# EAGLE design C5 Ambilight (EAGLE 9.2.2)
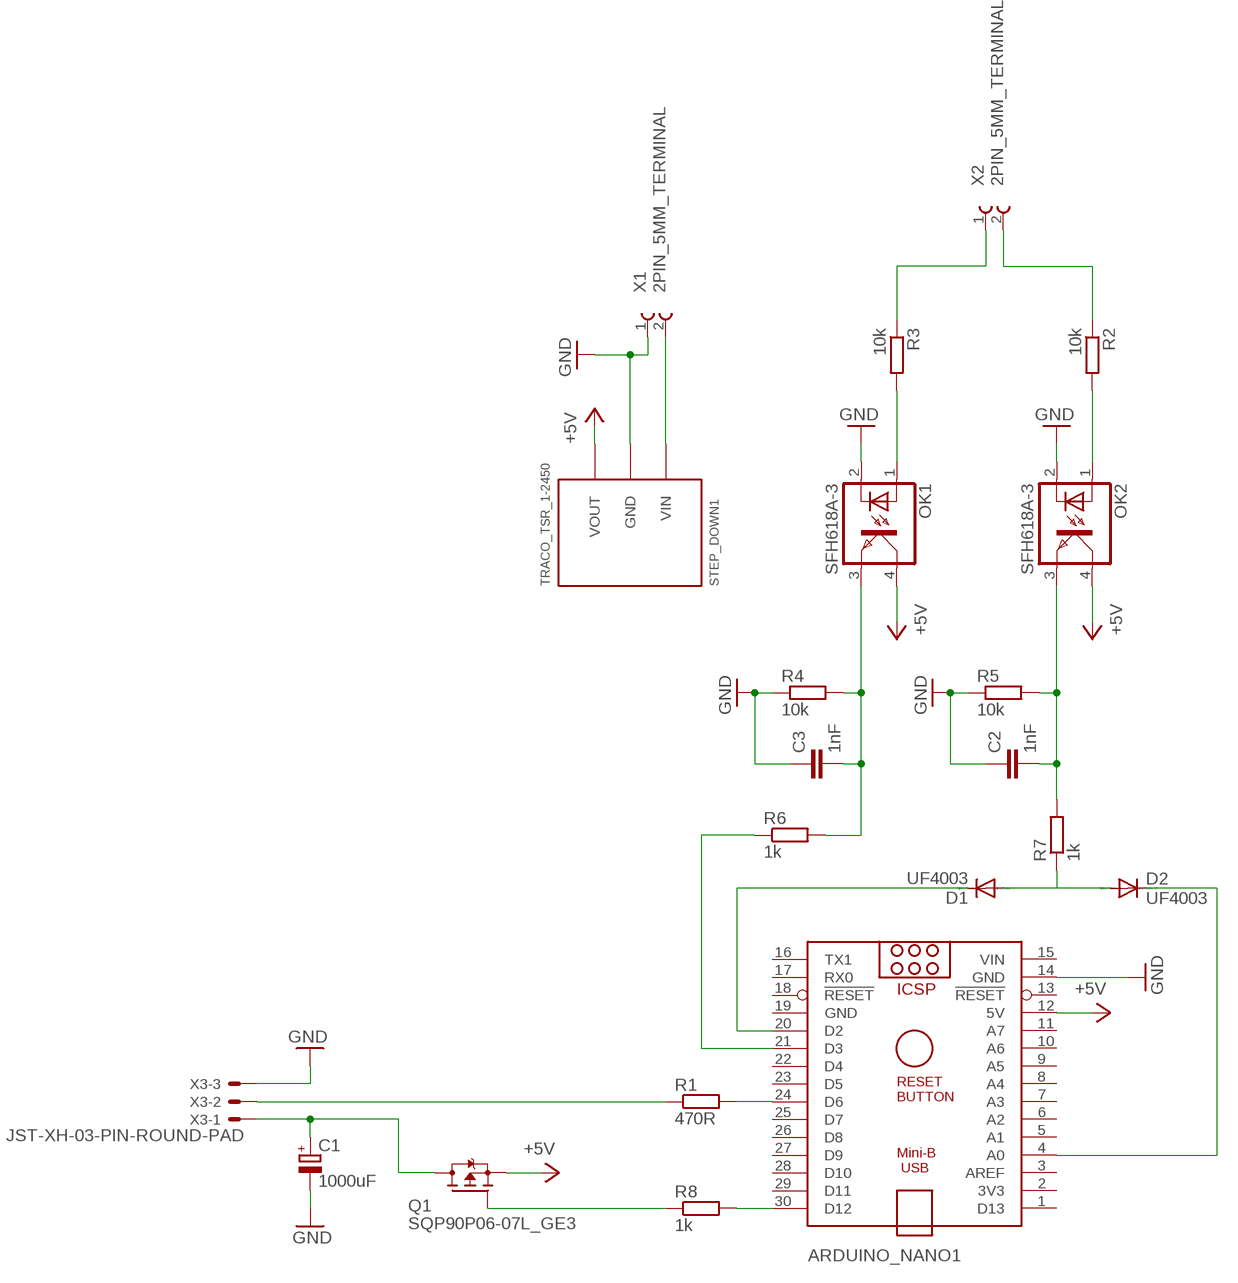
[diagram p0: schematic, sheet 1]

## Parts
ARDUINO_NANO1  ARDUINO_NANO  [ARDUINO_NANO]
C1  1000uF  CPOL-EUTT5D10  [TT5D10]
C2  1nF  C-EU050-025X075  [C050-025X075]
C3  1nF  C-EU050-025X075  [C050-025X075]
D1  UF4003  [DO41-10]
D2  UF4003  [DO41-10]
OK1  SFH618A-3  [DIP4]
OK2  SFH618A-3  [DIP4]
Q1  SQP90P06-07L_GE3  VISHAY_SQP90P06-07LTO220V  [TO220V]
R1  470R  R-EU_0207/10  [0207/10]
R2  10k  R-EU_0207/7  [0207/7]
R3  10k  R-EU_0207/7  [0207/7]
R4  10k  R-EU_0207/10  [0207/10]
R5  10k  R-EU_0207/10  [0207/10]
R6  1k  R-EU_0207/10  [0207/10]
R7  1k  R-EU_0207/10  [0207/10]
R8  1k  R-EU_0207/10  [0207/10]
STEP_DOWN1  TRACO_TSR_1-2450  [TRACO_TSR_1-2450]
X1  2PIN_5MM_TERMINAL  [2PIN_5MM_TERMMINAL]
X2  2PIN_5MM_TERMINAL  [2PIN_5MM_TERMMINAL]
X3  JST-XH-03-PIN-ROUND-PAD  [JST-XH-03-PACKAGE-ROUND-PAD]

## Nets
5V_LED: C1.+ Q1.2(D) X3.1
12V: STEP_DOWN1.VIN X1.2
+5V: ARDUINO_NANO1.12(5V) OK1.4(COL) OK2.4(COL) Q1.3(S) STEP_DOWN1.VOUT
GND: ARDUINO_NANO1.14(GND) C1.- C2.1 C3.1 OK1.2(C) OK2.2(C) R4.1 R5.1 STEP_DOWN1.GND X1.1 X3.3
N$1: ARDUINO_NANO1.30(D12) R8.2
N$2: ARDUINO_NANO1.24(D6) R1.2
N$3: R2.1 X2.2
N$4: R1.1 X3.2
N$5: R3.1 X2.1
N$6: OK1.1(A) R3.2
N$7: OK2.1(A) R2.2
N$8: C3.2 OK1.3(EMIT) R4.2 R6.2
N$9: C2.2 OK2.3(EMIT) R5.2 R7.2
N$10: Q1.1(G) R8.1
N$11: ARDUINO_NANO1.21(D3) R6.1
N$12: ARDUINO_NANO1.20(D2) D1.C
N$13: ARDUINO_NANO1.4(A0) D2.C
N$14: D1.A D2.A R7.1
Unconnected: ARDUINO_NANO1.1(D13) ARDUINO_NANO1.2(3V3) ARDUINO_NANO1.3(AREF) ARDUINO_NANO1.5(A1) ARDUINO_NANO1.6(A2) ARDUINO_NANO1.7(A3) ARDUINO_NANO1.8(A4) ARDUINO_NANO1.9(A5) ARDUINO_NANO1.10(A6) ARDUINO_NANO1.11(A7) ARDUINO_NANO1.13(!RESET) ARDUINO_NANO1.16(TX1) ARDUINO_NANO1.17(RX0) ARDUINO_NANO1.18(!RESET) ARDUINO_NANO1.22(D4) ARDUINO_NANO1.23(D5) ARDUINO_NANO1.25(D7) ARDUINO_NANO1.26(D8) ARDUINO_NANO1.27(D9) ARDUINO_NANO1.28(D10) ARDUINO_NANO1.29(D11)

## Power pins joined to a net without a drawn wire
GND: ARDUINO_NANO1.19(GND)
VIN: ARDUINO_NANO1.15(VIN)

## Library data of the parts
ARDUINO_NANO1 = Nano:ARDUINO_NANO: Arduino Nano V3.0 Overview: The Arduino Nano is a small, complete, and breadboard-friendly board based on the ATmega328 (Arduino Nano 3.x) or ATmega168 (Arduino Nano 2.x). It has more or less the same functionality of the Arduino Duemilanove, but in a different package. It lacks only a DC power jack, and works with a Mini-B USB cable instead of a standard one. The Nano was designed and is being produced by Gravitech. Specifications: Microcontroller Atmel ATmega168 or ATmega328 Operating Voltage (logic level) 5 V Input Voltage (recommended) 7-12 V Input Voltage (limits) 6-20 V Digital I/O Pins 14 (of which 6 provide PWM output) Analog Input Pins 8 DC Current per I/O Pin 40 mA Flash Memory 16 KB (ATmega168) or 32 KB (ATmega328) of which 2 KB used by bootloader SRAM 1 KB (ATmega168) or 2 KB (ATmega328) EEPROM 512 bytes (ATmega168) or 1 KB (ATmega328) Clock Speed 16 MHz Dimensions 0.73" x 1.70" Length 45 mm Width 18 mm Weigth 5 g Power: The Arduino Nano can be powered via the Mini-B USB connection, 6-20V unregulated external power supply (pin 30), or 5V regulated external power supply (pin 27). The power source is automatically selected to the highest voltage source. Memory: The ATmega168 has 16 KB of flash memory for storing code (of which 2 KB is used for the bootloader); the ATmega328 has 32 KB, (also with 2 KB used for the bootloader). The ATmega168 has 1 KB of SRAM and 512 bytes of EEPROM (which can be read and written with the EEPROM library); the ATmega328 has 2 KB of SRAM and 1 KB of EEPROM. Input and Output: Each of the 14 digital pins on the Nano can be used as an input or output, using pinMode(), digitalWrite(), and digitalRead() functions. They operate at 5 volts. Each pin can provide or receive a maximum of 40 mA and has an internal pull-up resistor (disconnected by default) of 20-50 kOhms. In addition, some pins have specialized functions. Visit Arduino - ArduinoBoardNano <https://www.arduino.cc/en/Main/ArduinoBoardNano>
C1 = resistor:CPOL-EU: POLARIZED CAPACITOR, European symbol
C2 C3 = resistor:C-EU: CAPACITOR, European symbol
D1 D2 = diode:UF4003: DIODE ultrafast recovery diode, 200 V rectifier
OK1 OK2 = optocoupler:SFH618?*: Optocoupler, Phototransistor Output, Low Input Current Source: Data sheet <http://www.vishay.com/docs/83673/sfh618.pdf>; MF: VISHAY/TELEFUNKEN; MPN: SFH618A-3; OC_FARNELL: 1020374; OC_NEWARK: 58K2209
Q1 = transistor-fet:VISHAY_SQP90P06-07L
R1-R8 = resistor:R-EU_: RESISTOR, European symbol
STEP_DOWN1 = Voltage:TRACO_TSR_1-2450
X1 X2 = Terminaly:2PIN_5MM_TERMINAL
X3 = JST XH Connectors v1-0:JST-XH-03-PIN: JST XH Connector 2 Pin Wire to board connector. Pitch: 2,54 mm, (0.100") Number of pins: 3 Created by Rembrandt Electronics www.rembrandtelectronics.com

## Board
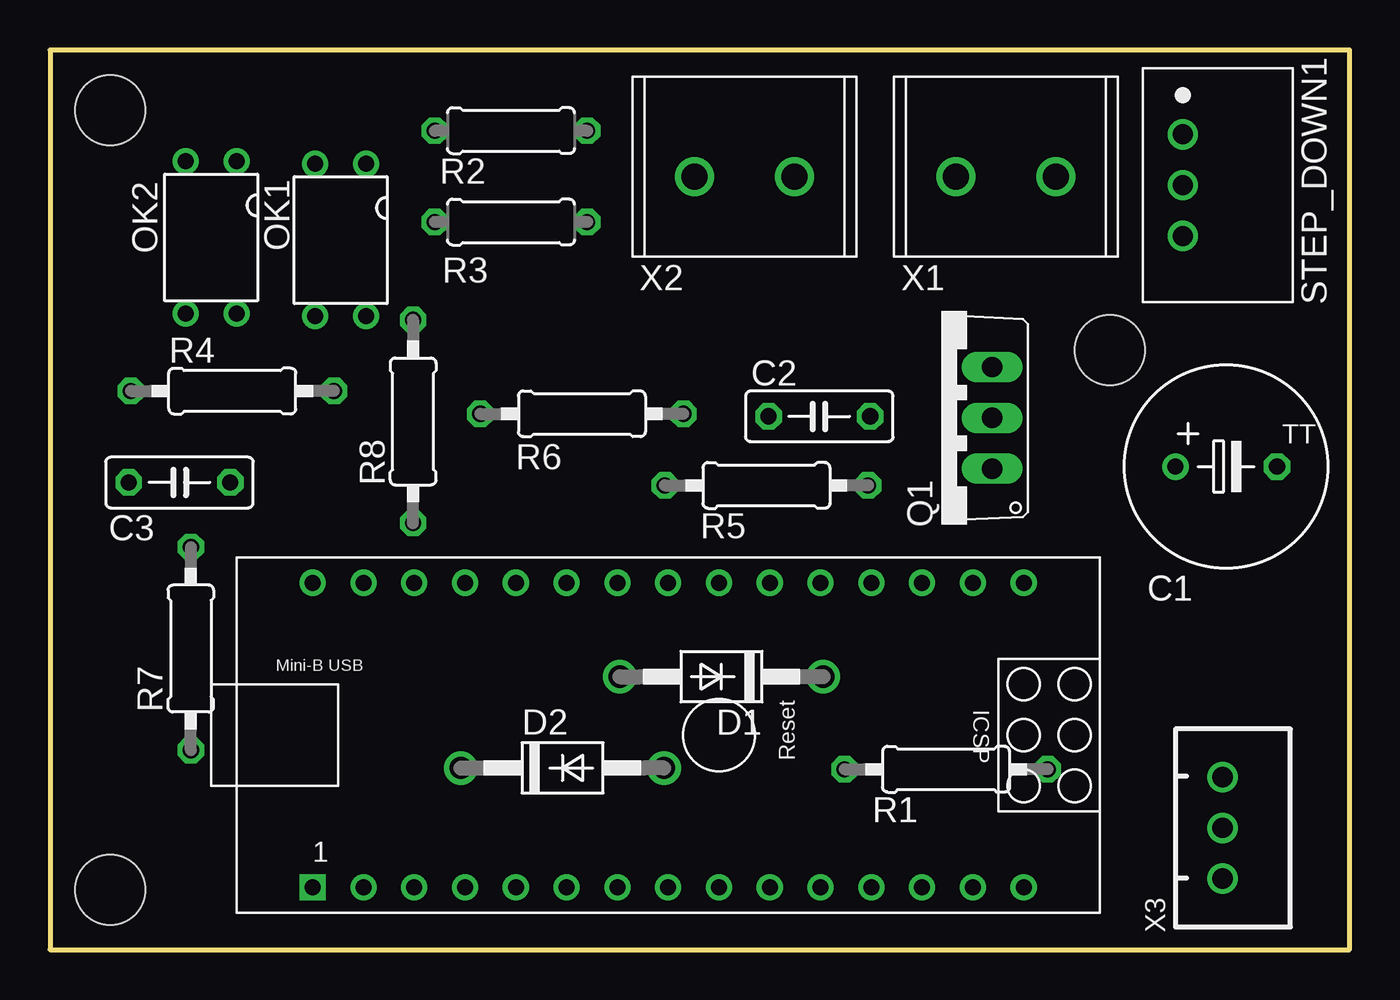
[diagram p1: board, top side]
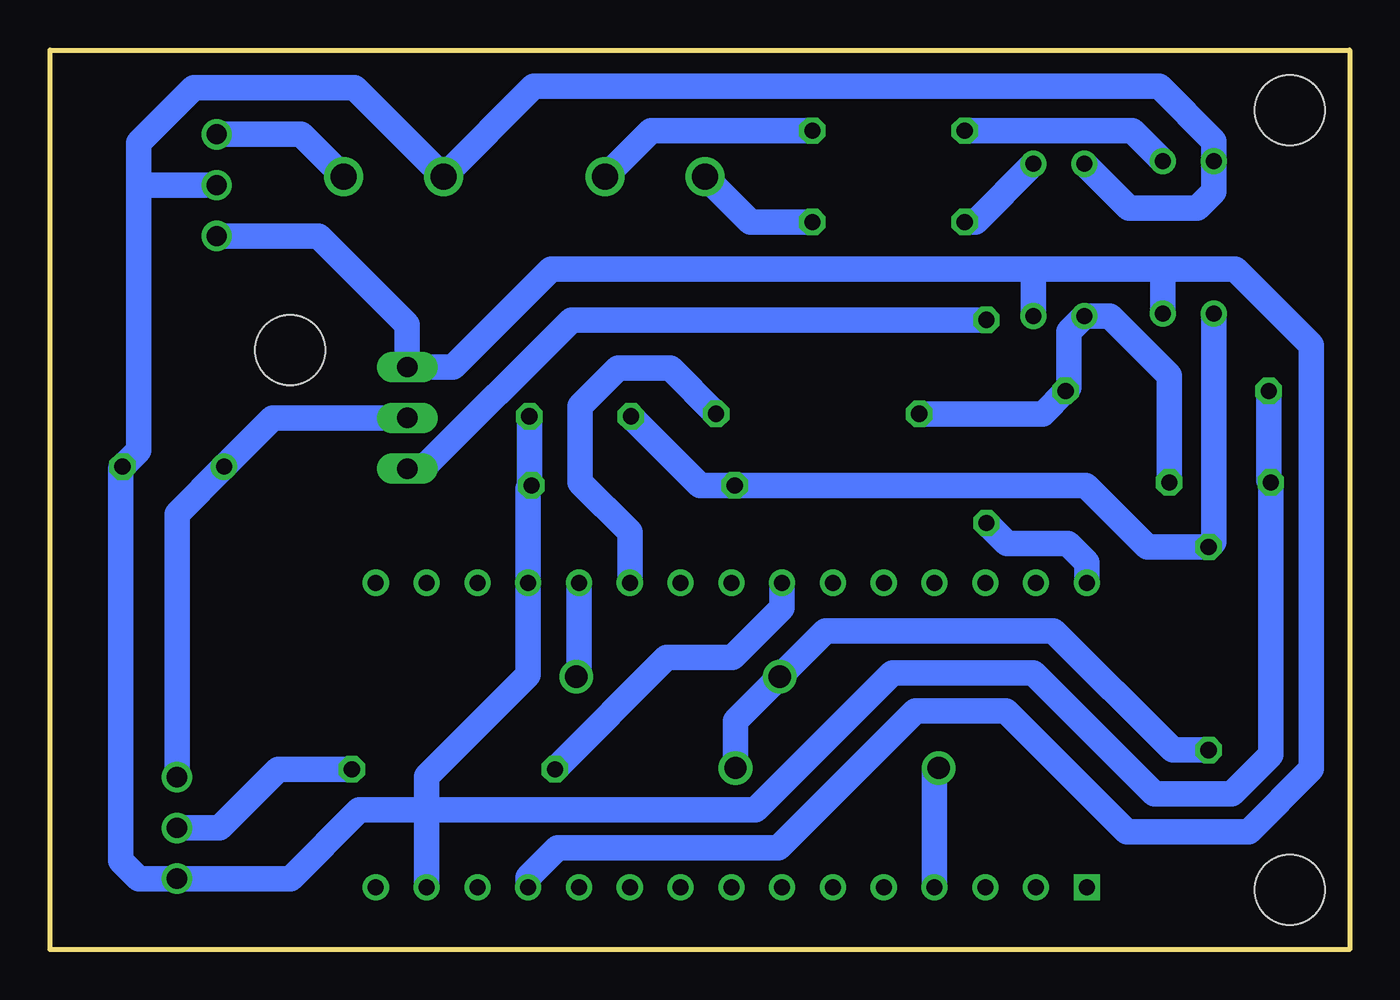
[diagram p2: board, bottom side, seen from below]

Size 65 x 45 mm. Coordinates in mm from the lower left corner, seen from the top.
Outline: 0,0 65,0 65,45 0,45 0,0
Copper layers (1*16): Top 0.035mm / dielectric 1.5mm / Bottom 0.035mm
Design rules "default": minimum track width 6mil, minimum drill 0.35mm, track to track 6mil, track to pad 6mil, pad to pad 6mil, via to via 6mil, smd to smd 6mil, copper to edge 40mil, drill to drill 6mil, minimum pad ring 10mil, minimum via ring 8mil, stop-mask expansion 4mil, vias tented up to drill 0mil, thermal gap 10mil
Holes 3.5 mm at 3,42 3,3 53,30

### Footprints (pad centres in the part's own frame; a part is rotated, then mirrored left to right if it is on the bottom)
ARDUINO_NANO = drill 0.8 square: 1 -20.32,-7.62 | drill 0.8: 2 -17.78,-7.62; 3 -15.24,-7.62; 4 -12.7,-7.62; 5 -10.16,-7.62; 6 -7.62,-7.62; 7 -5.08,-7.62; 8 -2.54,-7.62; 9 0,-7.62; 10 2.54,-7.62; 11 5.08,-7.62; 12 7.62,-7.62; 13 10.16,-7.62; 14 12.7,-7.62; 15 15.24,-7.62; 16 15.24,7.62; 17 12.7,7.62; 18 10.16,7.62; 19 7.62,7.62; 20 5.08,7.62; 21 2.54,7.62; 22 0,7.62; 23 -2.54,7.62; 24 -5.08,7.62; 25 -7.62,7.62; 26 -10.16,7.62; 27 -12.7,7.62; 28 -15.24,7.62; 29 -17.78,7.62; 30 -20.32,7.62
TT5D10 = drill 0.813: + -2.54,0 | drill 0.813 octagon: - 2.54,0
C050-025X075 = drill 0.813 octagon: 1 -2.54,0; 2 2.54,0
DO41-10 = drill 1.118: A 5.08,0; C -5.08,0
DIP4 = drill 0.8: 1 -1.27,-3.81; 2 1.27,-3.81; 3 1.27,3.81; 4 -1.27,3.81
TO220V = drill 1.016 long: 1 -2.54,-2.54; 2 0,-2.54; 3 2.54,-2.54
0207/10 = drill 0.813 octagon: 1 -5.08,0; 2 5.08,0
0207/7 = drill 0.813 octagon: 1 -3.81,0; 2 3.81,0
TRACO_TSR_1-2450 = drill 1: GND -0.01,-1.75; VIN -2.55,-1.75; VOUT 2.53,-1.75
2PIN_5MM_TERMMINAL = drill 1.3: 1 -2.5,0; 2 2.5,0
JST-XH-03-PACKAGE-ROUND-PAD = drill 1.016: 1 -2.54,0; 2 0,0; 3 2.54,0

### Placement (x,y rotation side)
ARDUINO_NANO1  33.46,10.73 0 top
C1  58.83,24.16 0 top
C2  38.48,26.67 180 top
C3  6.48,23.37 0 top
D1  33.59,13.65 180 top
D2  25.63,9.09 0 top
OK1  14.54,35.49 180 top
OK2  8.06,35.62 180 top
Q1  44.59,26.6 90 top
R1  44.82,9.02 180 top
R2  23.05,40.96 180 top
R3  23.05,36.39 180 top
R4  9.12,27.94 0 top
R5  35.84,23.22 180 top
R6  26.6,26.8 180 top
R7  7.04,15.06 90 top
R8  18.16,26.42 270 top
STEP_DOWN1  58.42,38.23 270 top
X1  47.82,38.67 0 top
X2  34.73,38.67 0 top
X3  58.65,6.09 270 top

### Tracks (layer width: path | path; a pad name or v marks a point on that pad's centre or on a via)
5V_LED
  Bottom 1.27: Q1.2 53.85,26.6 C1.+ 58.65,21.8 X3.1
12V
  Bottom 1.27: X1.2 52.43,40.78 STEP_DOWN1.VIN
+5V
  Bottom 1.27: STEP_DOWN1.VOUT 51.57,35.7 47.13,31.26 Q1.3 44.83,29.14 39.93,34.04 15.81,34.04 | 15.81,34.04 OK1.4 | 9.33,34.04 5.71,34.04 1.91,30.23 1.91,9.03 5.03,5.9 11.14,5.9 17.18,11.94 21.72,11.94 28.57,5.08 39.62,5.08 41.08,3.62 ARDUINO_NANO1.12 | OK2.4 9.33,34.04 | 9.33,34.04 15.81,34.04
GND
  Bottom 1.27: STEP_DOWN1.GND 60.57,38.24 | 60.57,38.24 60.57,40.36 57.82,43.11 49.76,43.11 X1.1 40.81,43.18 9.53,43.18 6.79,40.45 OK2.2 6.79,37.91 7.62,37.08 11.05,37.08 OK1.2 | 60.57,38.24 60.57,24.96 C1.- 61.47,24.06 61.47,4.45 60.57,3.55 X3.3 52.97,3.55 49.53,6.99 46.16,6.99 | 46.16,4 ARDUINO_NANO1.14 46.16,6.99 | C2.1 41.02,23.32 R5.1 41.08,23.05 ARDUINO_NANO1.19 41.08,13.75 46.16,8.67 46.16,6.99 | 46.16,6.99 29.72,6.99 22.86,13.84 15.81,13.84 9.76,7.79 5.9,7.79 3.94,9.74 C3.1 4.04,23.47 R4.1
N$1
  Bottom 1.27: ARDUINO_NANO1.30 13.14,19.36 14.1,20.32 17.14,20.32 R8.2
N$2
  Bottom 1.27: ARDUINO_NANO1.24 28.38,17.09 30.86,14.61 34.15,14.61 R1.2
N$3
  Bottom 1.27: R2.1 33.3,40.96 34.94,40.96 X2.2
N$4
  Bottom 1.27: X3.2 56.52,6.09 53.59,9.02 R1.1
N$5
  Bottom 1.27: X2.1 29.95,36.39 R3.1
N$6
  Bottom 1.27: OK1.1 18.72,36.39 R3.2
N$7
  Bottom 1.27: R2.2 10.86,40.96 OK2.1
N$8
  Bottom 1.27: C3.2 9.02,28.7 12,31.68 OK1.3 14.03,30.92 14.03,28.11 R4.2 15.35,26.8 R6.2
N$9
  Bottom 1.27: OK2.3 6.79,20.39 R7.2 10.1,20.14 13.18,23.22 R5.2 32.49,23.22 C2.2
N$10
  Bottom 1.27: R8.1 38.92,31.5 46.36,24.06 Q1.1
N$11
  Bottom 1.27: ARDUINO_NANO1.21 36,20.89 38.48,23.37 38.48,27.18 36.58,29.08 33.97,29.08 R6.1
N$12
  Bottom 1.27: ARDUINO_NANO1.20 38.54,13.78 D1.C
N$13
  Bottom 1.27: D2.C 20.76,8.88 ARDUINO_NANO1.4
N$14
  Bottom 1.27: D2.A 30.71,11.44 D1.A 26.22,15.93 14.8,15.93 8.84,9.98 R7.1